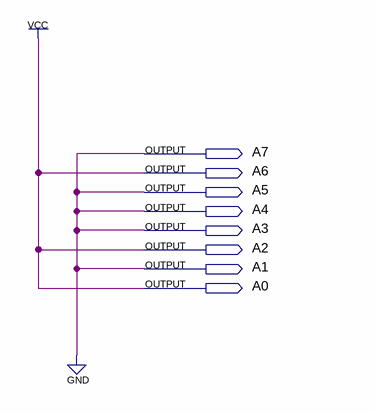
[diagram p0: schematic sheet]
// Quartus schematic addressOFJXT.bdf as structural Verilog: 0 symbols, 8 pins
module addressOFJXT (
  output A7,
  output A6,
  output A5,
  output A4,
  output A3,
  output A2,
  output A1,
  output A0
);


  assign A0 = 1'b1;
  assign A1 = 1'b0;
  assign A2 = 1'b1;
  assign A3 = 1'b0;
  assign A4 = 1'b0;
  assign A5 = 1'b0;
  assign A6 = 1'b1;
  assign A7 = 1'b0;
endmodule
